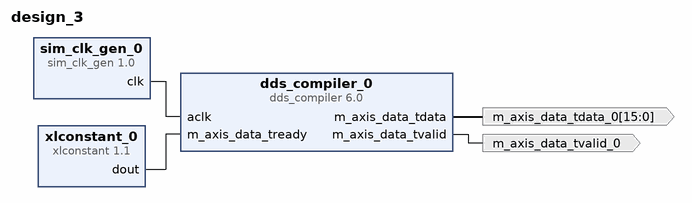
[diagram p0: block diagram of the top level]
# Vivado block design design_3, xc7z020clg400-1, Vivado 2025.2
create_bd_design design_3

create_bd_port -dir O -from 15 -to 0 m_axis_data_tdata_0
create_bd_port -dir O m_axis_data_tvalid_0

create_bd_cell -type ip -vlnv xilinx.com:ip:sim_clk_gen:1.0 sim_clk_gen_0
create_bd_cell -type ip -vlnv xilinx.com:ip:dds_compiler:6.0 dds_compiler_0
set_property -dict [list \
  CONFIG.DATA_Has_TLAST Not_Required \
  CONFIG.Frequency_Resolution 0.4 \
  CONFIG.Has_ARESETn false \
  CONFIG.Has_Phase_Out false \
  CONFIG.Has_TREADY true \
  CONFIG.Latency 9 \
  CONFIG.M_DATA_Has_TUSER Not_Required \
  CONFIG.M_PHASE_Has_TUSER Not_Required \
  CONFIG.Noise_Shaping None \
  CONFIG.OUTPUT_FORM Twos_Complement \
  CONFIG.Output_Frequency1 0 \
  CONFIG.Output_Selection Sine \
  CONFIG.Output_Width 16 \
  CONFIG.PINC1 1111111111 \
  CONFIG.Parameter_Entry Hardware_Parameters \
  CONFIG.Phase_Increment Fixed \
  CONFIG.Phase_Width 16 \
  CONFIG.Phase_offset None \
  CONFIG.S_PHASE_Has_TUSER Not_Required \
  CONFIG.S_PHASE_TUSER_Width 1 \
] [get_bd_cells dds_compiler_0]
create_bd_cell -type ip -vlnv xilinx.com:ip:xlconstant:1.1 xlconstant_0

# ---- connections ----

connect_bd_net [get_bd_pins dds_compiler_0/m_axis_data_tdata] [get_bd_ports m_axis_data_tdata_0]
connect_bd_net [get_bd_pins dds_compiler_0/m_axis_data_tvalid] [get_bd_ports m_axis_data_tvalid_0]
connect_bd_net [get_bd_pins sim_clk_gen_0/clk] [get_bd_pins dds_compiler_0/aclk]
connect_bd_net [get_bd_pins xlconstant_0/dout] [get_bd_pins dds_compiler_0/m_axis_data_tready]

validate_bd_design
save_bd_design
